# Altium schematic sheet SCH_FOCShield.SchDoc
size A3
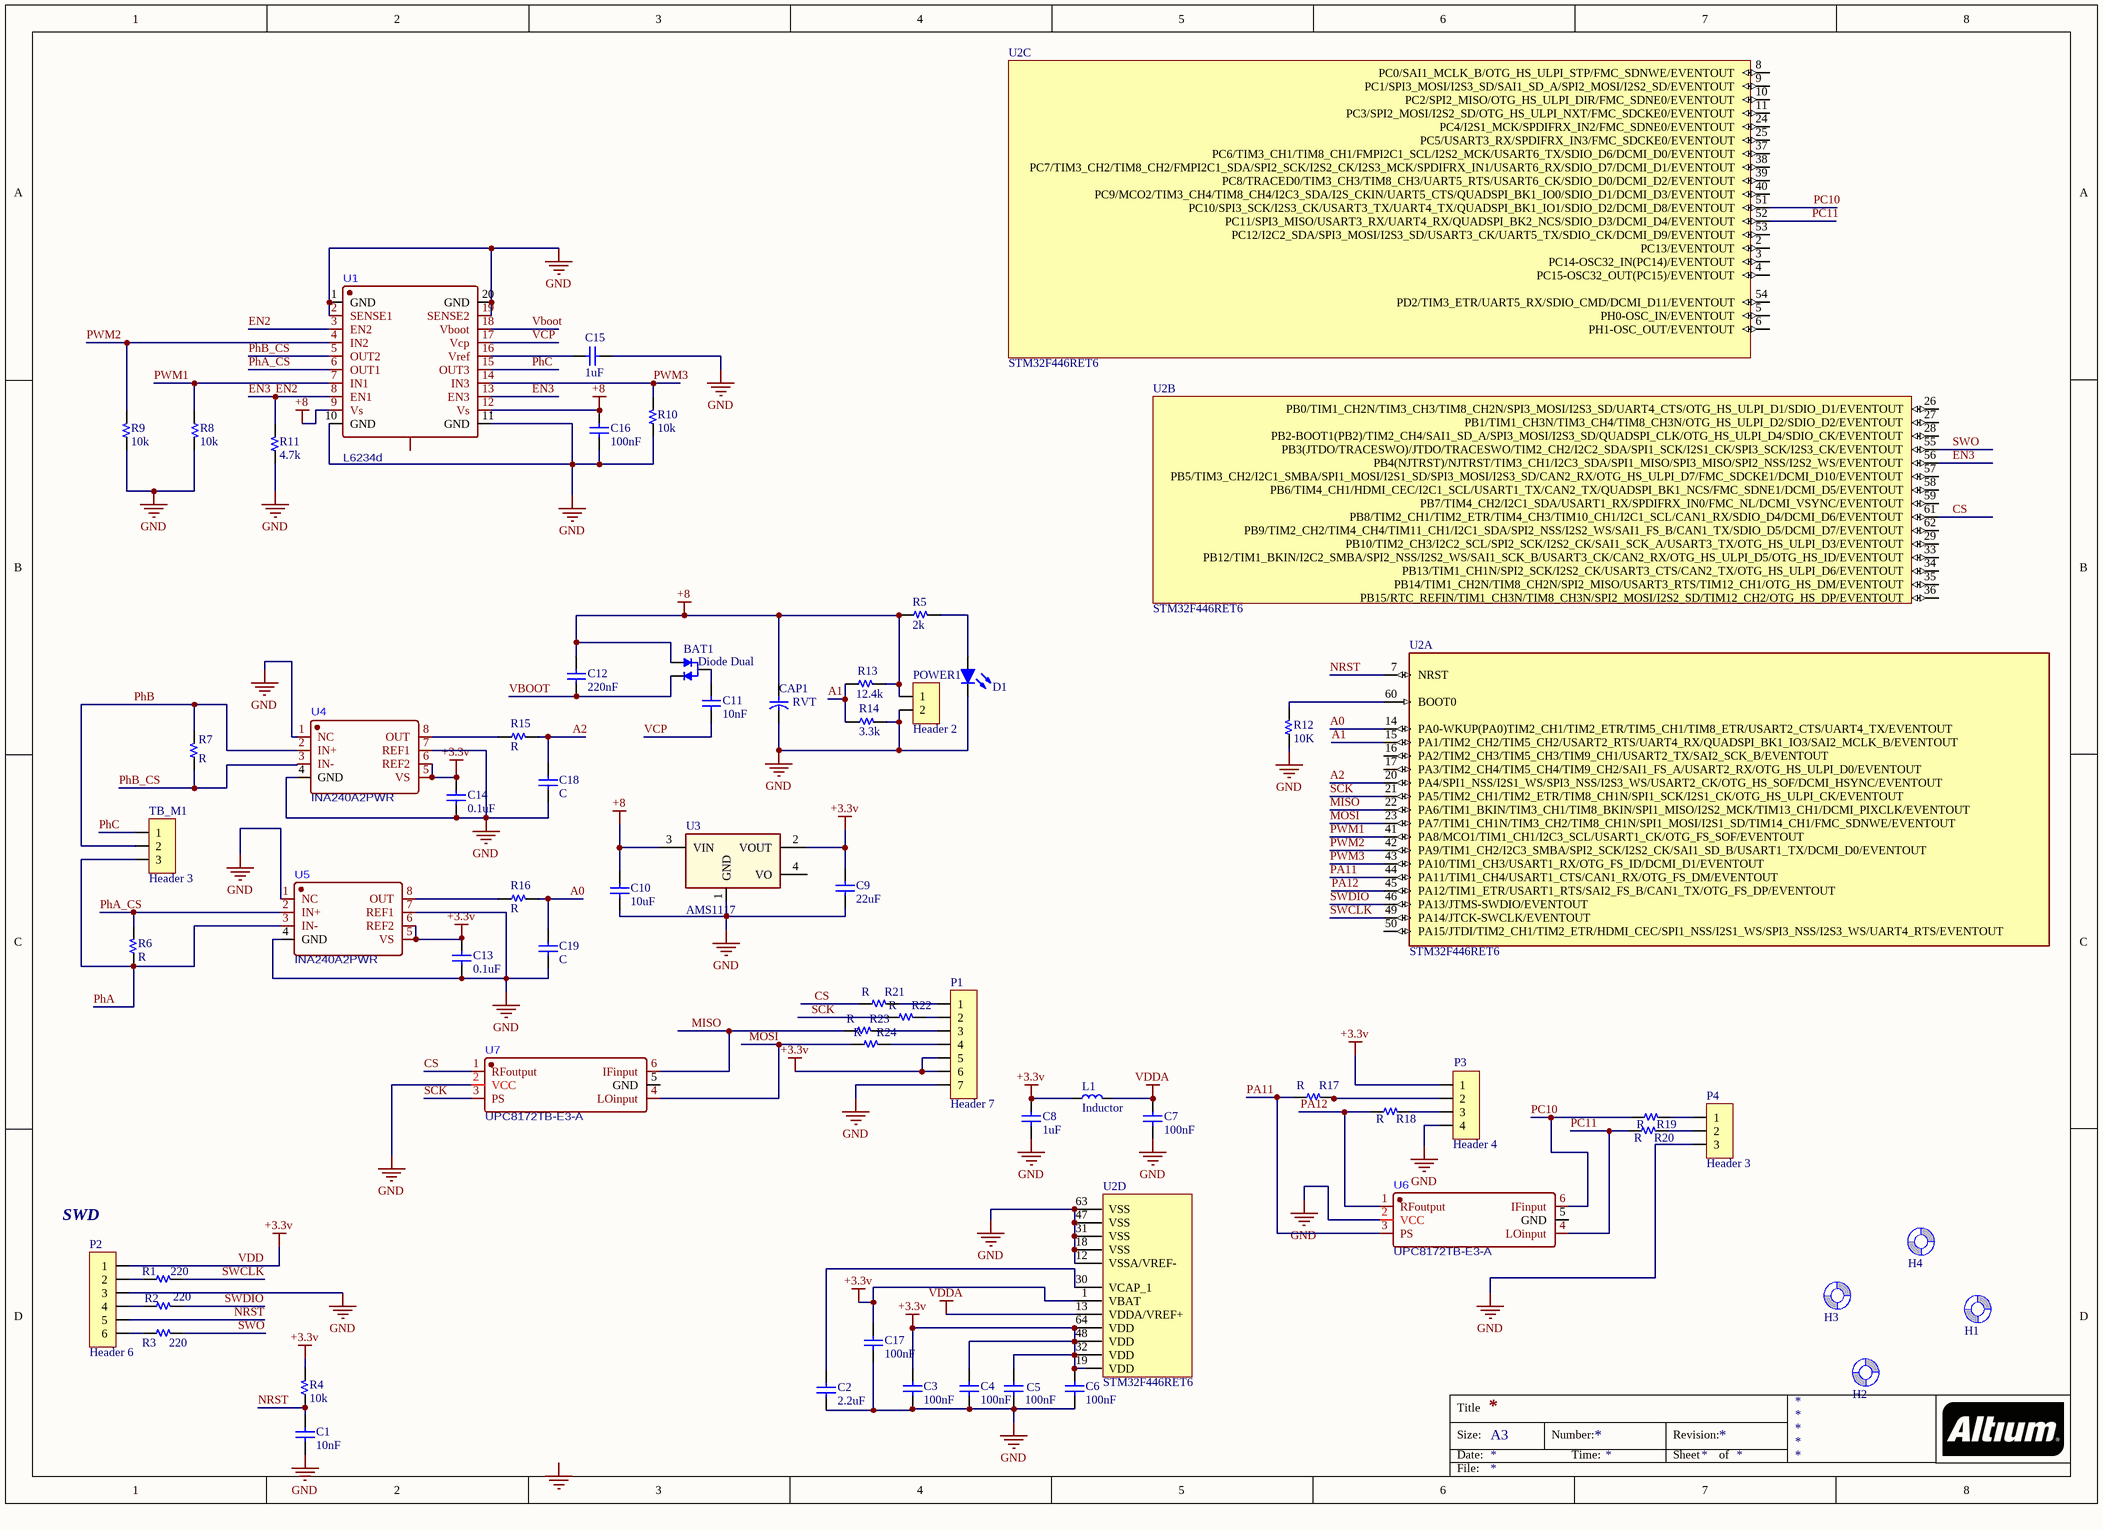
[diagram p0: SCH_FOCShield.SchDoc]

## Parts
BAT1  Diode Dual  [SOT-23]
C1  10nF  [C 0805]
C2  2.2uF  [C 0805]
C3  100nF  [C 0805]
C4  100nF  [C 0805]
C5  100nF  [C 0805]
C6  100nF  [C 0805]
C7  100nF  [C 0805]
C8  1uF  [C 0805]
C9  22uF  [C 0805]
C10  10uF  [C 0805]
C11  10nF  [C 0805]
C12  220nF  [C 0805]
C13  0.1uF  [C 0805]
C14  0.1uF  [C 0805]
C15  1uF  [C 0805]
C16  100nF  [C 0805]
C17  100nF  [C 0805]
C18  C  [C 0805]
C19  C  [C 0805]
CAP1  RVT  [C SMD ALU (F) DUAL]
D1  Led  [Led 0805 Blue]  (value not drawn)
H1  Screw Hole  [SCREW/3.0/6.0]  (value not drawn)  (no BOM)
H2  Screw Hole  [SCREW/3.0/6.0]  (value not drawn)  (no BOM)
H3  Screw Hole  [SCREW/3.0/6.0]  (value not drawn)  (no BOM)
H4  Screw Hole  [SCREW/3.0/6.0]  (value not drawn)  (no BOM)
L1  Inductor  [L 0805]
P1  Header 7  [HDR/Header/7/2mm]
P2  Header 6  [HDR/Header/6/2mm]
P3  Header 4  [HDR/Header/4/2mm]
P4  Header 3  [HDR/Header/3/2mm]
POWER1  Header 2  [HDR/Terminal/2]
R1  220  [R 0805]
R2  220  [R 0805]
R3  220  [R 0805]
R4  10k  [R 0805]
R5  2k  [R 0805]
R6  R  [R 2512]
R7  R  [R 2512]
R8  10k  [R 0805]
R9  10k  [R 0805]
R10  10k  [R 0805]
R11  4.7k  [R 0805]
R12  10K  [R 0805]
R13  12.4k  [R 0805]
R14  3.3k  [R 0805]
R15  R  [R 0805]
R16  R  [R 0805]
R17  R  [R 0805]
R18  R  [R 0805]
R19  R  [R 0805]
R20  R  [R 0805]
R21  R  [R 0805]
R22  R  [R 0805]
R23  R  [R 0805]
R24  R  [R 0805]
TB_M1  Header 3  [HDR/Terminal/3]
U1  L6234d  [L6234]
U2  STM32F446RET6  [QFP50P1200X1200X160-64N]  (parts A,B,C,D of 4)
U3  AMS1117  [SOT-223]
U4  INA240A2PWR  [INA240PD]
U5  INA240A2PWR  [INA240PD]
U6  UPC8172TB-E3-A  [SOT-363_L2.0-W1.3-P0.65-LS2.1-BR_SMF05CT]
U7  UPC8172TB-E3-A  [SOT-363_L2.0-W1.3-P0.65-LS2.1-BR_SMF05CT]

## Nets
+8: BAT1.1(A1) C10.1 C12.1 C16.2 CAP1.1 POWER1.1 R5.1 R13.2 U1.9(Vs) U1.12(Vs) U3.3(VIN)
GND: C1.2 C2.2 C3.2 C4.2 C5.2 C6.2 C7.2 C8.2 C9.2 C10.2 C13.2 C14.2 C15.2 C16.1 C17.1 C18.2 C19.2 CAP1.2 D1.2(K) P1.7 P2.3 P3.4 P4.3 POWER1.2 R8.2 R9.1 R10.1 R11.1 R12.1 R14.2 U1.1(GND) U1.2(SENSE1) U1.10(GND) U1.11(GND) U1.19(SENSE2) U1.20(GND) U2.12(VSSA/VREF-) U2.18(VSS) U2.31(VSS) U2.47(VSS) U2.63(VSS) U3.1(GND) U4.1(NC) U4.4(GND) U4.7(REF1) U5.1(NC) U5.4(GND) U5.7(REF1) U6.2(VCC) U7.2(VCC)
VDD: C3.1 C4.1 C5.1 C6.1 C8.1 C9.1 C13.1 C14.1 C17.2 L1.1 P1.5 P1.6 P2.1 P3.1 R4.2 U2.1(VBAT) U2.19(VDD) U2.32(VDD) U2.48(VDD) U2.64(VDD) U3.2(VOUT) U4.5(VS) U4.6(REF2) U5.5(VS) U5.6(REF2)  [also labelled +3.3v]
VDDA: C7.1 L1.2 U2.13(VDDA/VREF+)
A0: C19.1 R16.2 U2.14(PA0-WKUP(PA0)TIM2_CH1/TIM2_ETR/TIM5_CH1/TIM8_ETR/USART2_CTS/UART4_TX/EVENTOUT)
A1: R13.1 R14.1 U2.15(PA1/TIM2_CH2/TIM5_CH2/USART2_RTS/UART4_RX/QUADSPI_BK1_IO3/SAI2_MCLK_B/EVENTOUT)
A2: C18.1 R15.2 U2.20(PA4/SPI1_NSS/I2S1_WS/SPI3_NSS/I2S3_WS/USART2_CK/OTG_HS_SOF/DCMI_HSYNC/EVENTOUT)
CS: R21.1 U2.61(PB8/TIM2_CH1/TIM2_ETR/TIM4_CH3/TIM10_CH1/I2C1_SCL/CAN1_RX/SDIO_D4/DCMI_D6/EVENTOUT) U7.1(RFoutput)
EN2: R11.2 U1.3(EN2) U1.8(EN1) U1.13(EN3) U2.56(PB4(NJTRST)/NJTRST/TIM3_CH1/I2C3_SDA/SPI1_MISO/SPI3_MISO/SPI2_NSS/I2S2_WS/EVENTOUT)  [also labelled EN3]
MISO: R23.1 U2.22(PA6/TIM1_BKIN/TIM3_CH1/TIM8_BKIN/SPI1_MISO/I2S2_MCK/TIM13_CH1/DCMI_PIXCLK/EVENTOUT) U7.6(IFinput)
MOSI: R24.1 U2.23(PA7/TIM1_CH1N/TIM3_CH2/TIM8_CH1N/SPI1_MOSI/I2S1_SD/TIM14_CH1/FMC_SDNWE/EVENTOUT) U7.4(LOinput)
NRST: C1.1 P2.5 R4.1 U2.7(NRST)
PA11: R17.1 U2.44(PA11/TIM1_CH4/USART1_CTS/CAN1_RX/OTG_FS_DM/EVENTOUT) U6.3(PS)
PA12: R18.1 U2.45(PA12/TIM1_ETR/USART1_RTS/SAI2_FS_B/CAN1_TX/OTG_FS_DP/EVENTOUT) U6.1(RFoutput)
PC10: R19.1 U2.51(PC10/SPI3_SCK/I2S3_CK/USART3_TX/UART4_TX/QUADSPI_BK1_IO1/SDIO_D2/DCMI_D8/EVENTOUT) U6.6(IFinput)
PC11: R20.1 U2.52(PC11/SPI3_MISO/USART3_RX/UART4_RX/QUADSPI_BK2_NCS/SDIO_D3/DCMI_D4/EVENTOUT) U6.4(LOinput)
PhA: R6.1 TB_M1.3 U5.3(IN-)
PhA_CS: R6.2 U1.6(OUT1) U5.2(IN+)
PhB: R7.2 TB_M1.2 U4.2(IN+)
PhB_CS: R7.1 U1.5(OUT2) U4.3(IN-)
PhC: TB_M1.1 U1.15(OUT3)
PWM1: R8.1 U1.7(IN1) U2.41(PA8/MCO1/TIM1_CH1/I2C3_SCL/USART1_CK/OTG_FS_SOF/EVENTOUT)
PWM2: R9.2 U1.4(IN2) U2.42(PA9/TIM1_CH2/I2C3_SMBA/SPI2_SCK/I2S2_CK/SAI1_SD_B/USART1_TX/DCMI_D0/EVENTOUT)
PWM3: R10.2 U1.14(IN3) U2.43(PA10/TIM1_CH3/USART1_RX/OTG_FS_ID/DCMI_D1/EVENTOUT)
SCK: R22.1 U2.21(PA5/TIM2_CH1/TIM2_ETR/TIM8_CH1N/SPI1_SCK/I2S1_CK/OTG_HS_ULPI_CK/EVENTOUT) U7.3(PS)
SWCLK: R1.2 U2.49(PA14/JTCK-SWCLK/EVENTOUT)
SWDIO: R2.2 U2.46(PA13/JTMS-SWDIO/EVENTOUT)
SWO: R3.2 U2.55(PB3(JTDO/TRACESWO)/JTDO/TRACESWO/TIM2_CH2/I2C2_SDA/SPI1_SCK/I2S1_CK/SPI3_SCK/I2S3_CK/EVENTOUT)
VBOOT: BAT1.2(A2) C12.2 U1.18(Vboot)
VCP: C11.2 U1.17(Vcp)
NetBAT1_3: BAT1.3(K) C11.1
NetC2_1: C2.1 U2.30(VCAP_1)
NetC15_1: C15.1 U1.16(Vref)
NetD1_1: D1.1(A) R5.2
NetP1_1: P1.1 R21.2
NetP1_2: P1.2 R22.2
NetP1_3: P1.3 R23.2
NetP1_4: P1.4 R24.2
NetP2_2: P2.2 R1.1
NetP2_4: P2.4 R2.1
NetP2_6: P2.6 R3.1
NetP3_2: P3.2 R17.2
NetP3_3: P3.3 R18.2
NetP4_1: P4.1 R19.2
NetP4_2: P4.2 R20.2
NetR12_2: R12.2 U2.60(BOOT0)
NetR15_1: R15.1 U4.8(OUT)
NetR16_1: R16.1 U5.8(OUT)

Not connected (* = marked no-connect by the designer): H1 1(Screw); H2 1(Screw); H3 1(Screw); H4 1(Screw); U1 21; U2 2(PC13/EVENTOUT) 3(PC14-OSC32_IN(PC14)/EVENTOUT) 4(PC15-OSC32_OUT(PC15)/EVENTOUT) 5(PH0-OSC_IN/EVENTOUT) 6(PH1-OSC_OUT/EVENTOUT) 8(PC0/SAI1_MCLK_B/OTG_HS_ULPI_STP/FMC_SDNWE/EVENTOUT) 9(PC1/SPI3_MOSI/I2S3_SD/SAI1_SD_A/SPI2_MOSI/I2S2_SD/EVENTOUT) 10(PC2/SPI2_MISO/OTG_HS_ULPI_DIR/FMC_SDNE0/EVENTOUT) 11(PC3/SPI2_MOSI/I2S2_SD/OTG_HS_ULPI_NXT/FMC_SDCKE0/EVENTOUT) 16(PA2/TIM2_CH3/TIM5_CH3/TIM9_CH1/USART2_TX/SAI2_SCK_B/EVENTOUT) 17(PA3/TIM2_CH4/TIM5_CH4/TIM9_CH2/SAI1_FS_A/USART2_RX/OTG_HS_ULPI_D0/EVENTOUT) 24(PC4/I2S1_MCK/SPDIFRX_IN2/FMC_SDNE0/EVENTOUT) 25(PC5/USART3_RX/SPDIFRX_IN3/FMC_SDCKE0/EVENTOUT) 26(PB0/TIM1_CH2N/TIM3_CH3/TIM8_CH2N/SPI3_MOSI/I2S3_SD/UART4_CTS/OTG_HS_ULPI_D1/SDIO_D1/EVENTOUT) 27(PB1/TIM1_CH3N/TIM3_CH4/TIM8_CH3N/OTG_HS_ULPI_D2/SDIO_D2/EVENTOUT) 28(PB2-BOOT1(PB2)/TIM2_CH4/SAI1_SD_A/SPI3_MOSI/I2S3_SD/QUADSPI_CLK/OTG_HS_ULPI_D4/SDIO_CK/EVENTOUT) 29(PB10/TIM2_CH3/I2C2_SCL/SPI2_SCK/I2S2_CK/SAI1_SCK_A/USART3_TX/OTG_HS_ULPI_D3/EVENTOUT) 33(PB12/TIM1_BKIN/I2C2_SMBA/SPI2_NSS/I2S2_WS/SAI1_SCK_B/USART3_CK/CAN2_RX/OTG_HS_ULPI_D5/OTG_HS_ID/EVENTOUT) 34(PB13/TIM1_CH1N/SPI2_SCK/I2S2_CK/USART3_CTS/CAN2_TX/OTG_HS_ULPI_D6/EVENTOUT) 35(PB14/TIM1_CH2N/TIM8_CH2N/SPI2_MISO/USART3_RTS/TIM12_CH1/OTG_HS_DM/EVENTOUT) 36(PB15/RTC_REFIN/TIM1_CH3N/TIM8_CH3N/SPI2_MOSI/I2S2_SD/TIM12_CH2/OTG_HS_DP/EVENTOUT) 37(PC6/TIM3_CH1/TIM8_CH1/FMPI2C1_SCL/I2S2_MCK/USART6_TX/SDIO_D6/DCMI_D0/EVENTOUT) 38(PC7/TIM3_CH2/TIM8_CH2/FMPI2C1_SDA/SPI2_SCK/I2S2_CK/I2S3_MCK/SPDIFRX_IN1/USART6_RX/SDIO_D7/DCMI_D1/EVENTOUT) 39(PC8/TRACED0/TIM3_CH3/TIM8_CH3/UART5_RTS/USART6_CK/SDIO_D0/DCMI_D2/EVENTOUT) 40(PC9/MCO2/TIM3_CH4/TIM8_CH4/I2C3_SDA/I2S_CKIN/UART5_CTS/QUADSPI_BK1_IO0/SDIO_D1/DCMI_D3/EVENTOUT) 50(PA15/JTDI/TIM2_CH1/TIM2_ETR/HDMI_CEC/SPI1_NSS/I2S1_WS/SPI3_NSS/I2S3_WS/UART4_RTS/EVENTOUT) 53(PC12/I2C2_SDA/SPI3_MOSI/I2S3_SD/USART3_CK/UART5_TX/SDIO_CK/DCMI_D9/EVENTOUT) 54(PD2/TIM3_ETR/UART5_RX/SDIO_CMD/DCMI_D11/EVENTOUT) 57(PB5/TIM3_CH2/I2C1_SMBA/SPI1_MOSI/I2S1_SD/SPI3_MOSI/I2S3_SD/CAN2_RX/OTG_HS_ULPI_D7/FMC_SDCKE1/DCMI_D10/EVENTOUT) 58(PB6/TIM4_CH1/HDMI_CEC/I2C1_SCL/USART1_TX/CAN2_TX/QUADSPI_BK1_NCS/FMC_SDNE1/DCMI_D5/EVENTOUT) 59(PB7/TIM4_CH2/I2C1_SDA/USART1_RX/SPDIFRX_IN0/FMC_NL/DCMI_VSYNC/EVENTOUT) 62(PB9/TIM2_CH2/TIM4_CH4/TIM11_CH1/I2C1_SDA/SPI2_NSS/I2S2_WS/SAI1_FS_B/CAN1_TX/SDIO_D5/DCMI_D7/EVENTOUT); U3 4(VO); U6 5(GND); U7 5(GND)

## Notes on the sheet
- (near P2) SWD
- Labels drawn without touching a wire or pin: GND
- Title
- Size:
- Date:
- A3
- Number:
- Time:
- Revision:
- Sheet
- of
- File:

## Library data of the parts
BAT1 = Diode Dual: Dual Default Diode
C1-C19 = Capacitor NP: Capacitor non-pol
CAP1 = Capacitor: Capacitor pol
D1 = Led: Typical LED
P1 = Header 7: Header, 7-Pin
P2 = Header 6: Header, 6-Pin
P3 = Header 4: Header, 4-Pin
P4 TB_M1 = Header 3: Header, 3-Pin
POWER1 = Header 2: Header, 2-Pin
R1-R24 = Resistor
U2 = STM32F446RET6: MCU 32-Bit STM32 ARM Cortex M4 RISC 512KB Flash 2.5V/3.3V 64-Pin LQFP Tray; Availability: Unavailable; Package: None; MP: STM32F446RET6; Value: *; Price: None
U3 = AMS1117: 1A LDO Voltage Regulator, ADJ or fixed 1.5/1.8/2.5/2.85/3.3/5V
H1-H4 = Screw Hole: TYPE: NO-BOM; UNIT PRICE: 0